# Altium schematic sheet LED.SchDoc
size A4
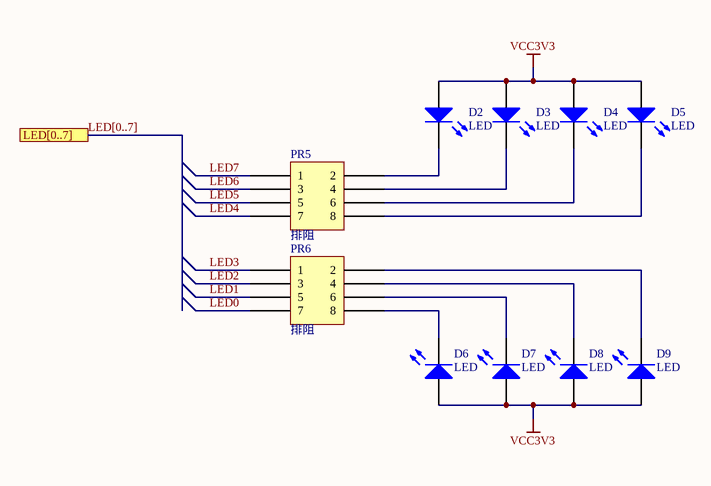
[diagram p0: LED.SchDoc]

## Parts
D2  LED  [LED0805]
D3  LED  [LED0805]
D4  LED  [LED0805]
D5  LED  [LED0805]
D6  LED  [LED0805]
D7  LED  [LED0805]
D8  LED  [LED0805]
D9  LED  [LED0805]
PR5  排阻  [8P4R-0603]
PR6  排阻  [8P4R-0603]

## Ports
LED[0..7]

## Nets
VCC3V3: D2.2(A) D3.2(A) D4.2(A) D5.2(A) D6.2(A) D7.2(A) D8.2(A) D9.2(A)
LED0: PR6.7
LED1: PR6.5
LED2: PR6.3
LED3: PR6.1
LED4: PR5.7
LED5: PR5.5
LED6: PR5.3
LED7: PR5.1
NetD2_1: D2.1(K) PR5.2
NetD3_1: D3.1(K) PR5.4
NetD4_1: D4.1(K) PR5.6
NetD5_1: D5.1(K) PR5.8
NetD6_1: D6.1(K) PR6.8
NetD7_1: D7.1(K) PR6.6
NetD8_1: D8.1(K) PR6.4
NetD9_1: D9.1(K) PR6.2

## Buses and harness runs
bus LED[0..7] = port LED[0..7]

## Library data of the parts
PR5 PR6 = RES*4